# Altium project Bluetooth_Module.PrjPcb
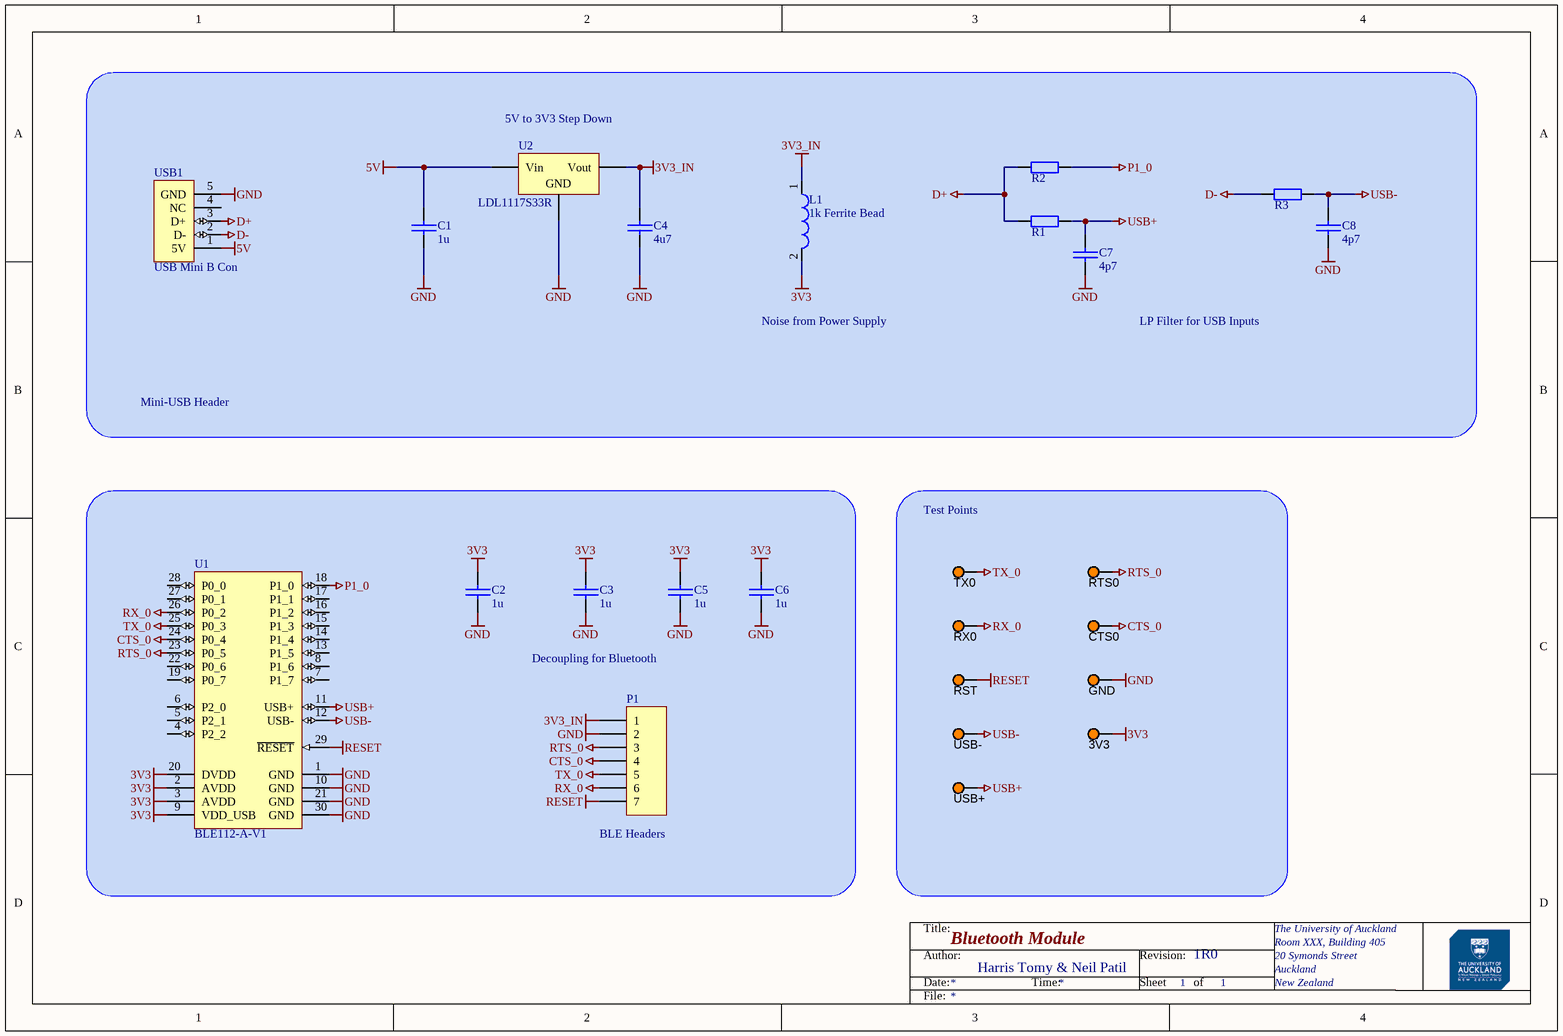
[diagram p0: Bluetooth_Module_V1.SchDoc]
1 sheet, 25 parts. Net scope: global (net labels, ports and power ports of the same name join across sheets).
Board files: BLE_Module_USB_Header.PcbDoc, BLE_Module.PcbDoc, BLE_utri092.PcbDoc

## Sheet Bluetooth_Module_V1.SchDoc: Bluetooth Module
size A4; Author: Harris Tomy & Neil Patil; Organization: The University of Auckland; Address1: Room XXX, Building 405; Address2: 20 Symonds Street; Address3: Auckland; Address4: New Zealand; Revision: 1R0; SheetNumber: 1; SheetTotal: 1

### Parts
3V3  5003  [TP_TH]  (value not drawn)
C1  1u  [C0805]
C2  1u  [C0805]
C3  1u  [C0805]
C4  4u7  [C1206]
C5  1u  [C0805]
C6  1u  [C0805]
C7  4p7  [C0805]
C8  4p7  [C0805]
CTS0  5003  [TP_TH]  (value not drawn)
GND  5003  [TP_TH]  (value not drawn)
L1  1k Ferrite Bead  [SMD-1206]
P1  BLE Headers  [HDR1X7]
R1  Resistor 0805  [R0805]  (value not drawn)
R2  Resistor 0805  [R0805]  (value not drawn)
R3  Resistor 0805  [R0805]  (value not drawn)
RST  5003  [TP_TH]  (value not drawn)
RTS0  5003  [TP_TH]  (value not drawn)
RX0  5003  [TP_TH]  (value not drawn)
TX0  5003  [TP_TH]  (value not drawn)
U1  BLE112-A-V1  [BLUE-BLE112-A-V1_V]
U2  LDL1117S33R  [SOT223L]
USB1  USB Mini B Con  [USB_UJ2MAB]
USB+  5003  [TP_TH]  (value not drawn)
USB-  5003  [TP_TH]  (value not drawn)

### Blocks framed on the sheet
Decoupling for Bluetooth: C2 C3 C5 C6 P1 U1
Test Points: 3V3 CTS0 GND RST RTS0 RX0 TX0 USB+ USB-

### Nets
3V3: 3V3.1 C2.2 C3.2 C5.2 C6.2 L1.2 U1.2(AVDD) U1.3(AVDD) U1.9(VDD_USB) U1.20(DVDD)
3V3_IN: C4.2 L1.1 P1.1 U2.2(Vout)
5V: C1.2 U2.3(Vin) USB1.1(5V)
CTS_0: CTS0.1 P1.4 U1.24(P0_4)
D+: R1.2 R2.1 USB1.3(D+)
D-: R3.2 USB1.2(D-)
GND: C1.1 C2.1 C3.1 C4.1 C5.1 C6.1 C7.1 C8.1 GND.1 P1.2 U1.1(GND) U1.10(GND) U1.21(GND) U1.30(GND) U2.1(GND) USB1.5(GND)
P1_0: R2.2 U1.18(P1_0)
RESET: P1.7 RST.1 U1.29(~{RESET})
RTS_0: P1.3 RTS0.1 U1.23(P0_5)
RX_0: P1.6 RX0.1 U1.26(P0_2)
TX_0: P1.5 TX0.1 U1.25(P0_3)
USB+: C7.2 R1.1 U1.11(USB+) USB+.1
USB-: C8.2 R3.1 U1.12(USB-) USB-.1

Not connected (* = marked no-connect by the designer): U1 4(P2_2) 5(P2_1) 6(P2_0) 7(P1_7) 8(P1_6) 13(P1_5) 14(P1_4) 15(P1_3) 16(P1_2) 17(P1_1) 19(P0_7) 22(P0_6) 27(P0_1) 28(P0_0); USB1 4(NC)

### Notes on the sheet
- (near U2) 5V to 3V3 Step Down
- Noise from Power Supply
- LP Filter for USB Inputs
- Mini-USB Header
- Title:
- Author:
- Date:
- Time:
- Revision:
- Sheet
- of
- File:

### Library data of the parts
3V3 CTS0 GND RST RTS0 RX0 TX0 USB+ USB- = TestPoint: Test Point, Orange, 1-Pin THD, RoHS; Peak Reverse Current: 600 uA; Forward Current: 3 A; Max Surge Current: 80 A; Forward Voltage: 1.08 V; Max Operating Temperature: 150 degC; PackageReference: 5003; Pins: 2; ComponentLink2URL: http://keyelco.com/userAssets/file/M65p56.pdf; PackageDescription: 1-Pin Through Hole Device, Dia 2.54 mm; Weight: 0.01 lb; Diameter: 5.3 mm; Mount: Through Hole; Package Quantity: 500; Packaging: Bulk; Min Operating Temperature: -65 degC; ComponentLink1Description: Manufacturer URL; Height: 0.25 inch; ComponentLink1URL: http://www.keyelco.com/; ComponentLink2Description: Datasheet; Width: 0.25 inch; REACH SVHC: No SVHC; RoHSCompliant: true; Radiation Hardening: No; Length: 9.5 mm; DatasheetVersion: Jun-15
C1-C3 C5-C8 = CCAP0805: Type: Surface Mount; MPN: ?; Part Description: ?; Value: ?
C4 = Cap CER Decoup C3216C0G2A104J160AC: CAP CER 0.1UF 100V C0G 1206; Manufacturer: TDK Corporation; Type: Surface mount; Value: 100nF/100V; MPN: C3216C0G2A104J160AC; Part Description: CAP CER 0.1UF 100V C0G 1206; Supplier 1: RSComponents; Supplier Part Number 1: 1795799; Supplier 2: Element14; Supplier Part Number 4: 810-C3216C0G2A104J6C; Supplier Part Number 3: 445-172677-1-ND; Supplier Part Number 2: 2906828; Supplier 4: Mouser; Supplier 3: Digi-Key
L1 = 742792113: SMD EMI Suppression Ferrite Bead WE-CBF, Z = 120 Ohm; Impedance: 120 Ohm; ComponentLink1Description: Manufacturer Link; ComponentLink2Description: Datasheet; DatasheetVersion: Dec-2005; ComponentLink1URL: http://www.we-online.com; PackageVersion: 2007; PackageDescription: Chip Inductor, 2-Leads, Body 3.2 x 1.6 mm; ComponentLink2URL: http://www.we-online.de/katalog/media/pdf/742792113.pdf; PackageReference: SMD-1206; PartNumber: 742792113
P1 = Header 7: Header, 7-Pin; LatestRevisionDate: 17-Jul-2002; LatestRevisionNote: Re-released for DXP Platform.; Publisher: Altium Limited
R1-R3 = RES0805: MPN: ?; Value: ?; Part Description: ?; Type: Surface Mount
U1 = BLE112-A-V1: Bluetooth(R) Low Energy Single Mode Module / , 2 to 3.6 V, -40 to 85 degC, 30-Pin SMD, RoHS, Tape and Reel; Min Supply Voltage: 2.1 V; Max Supply Voltage: 3.6 V; RoHSCompliant: true; ComponentLink1Description: Manufacturer URL; Min Operating Temperature: -40 degC; ComponentLink2Description: Datasheet; DatasheetVersion: Rev. 1.4, 05/2013; ComponentLink1URL: www.bluegiga.com; Packaging: Cut Tape; Pins: 64; REACH SVHC: No SVHC; Max Operating Temperature: 85 degC; PackageDescription: 30-Pin Surface Mount Device, Body 12.05 x 18.1 mm, Pitch 1.25 mm; ComponentLink2URL: http://www.mouser.com/ds/2/368/Bluegiga_Technologies_BLE112_Datasheet-558666.pdf; PackageReference: BLE112-A-V1; PartNumber: BLE112-A-V1
U2 = LDO LDL1117S33R: IC REG LINEAR 3.3V 1.2A SOT223; Manufacturer: STMicroelectronics; Value: 3.3V/1.2A; MPN: LDL1117S33R; Supplier 1: Element14; Type: Surface mount; Part Description: IC REG LINEAR 3.3V 1.2A SOT223; Supplier Part Number 3: 511-LDL1117S33R; Supplier Part Number 2: 497-17239-1-ND; Supplier Part Number 1: 2729708; Supplier 3: Mouser; Supplier 2: Digi-Key
USB1 = USBMiniB: Supplier 1: Digi-Key; Supplier Part Number 1: 102-4004-1-ND